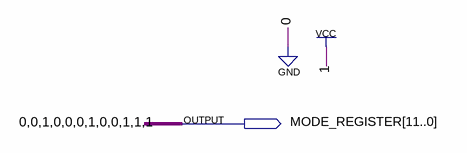
[diagram p0: schematic sheet]
// Quartus schematic dram_mr.bdf as structural Verilog: 0 symbols, 1 pins
module dram_mr (
  output [11:0] MODE_REGISTER
);


  assign MODE_REGISTER = 12'b001000100111;
endmodule
